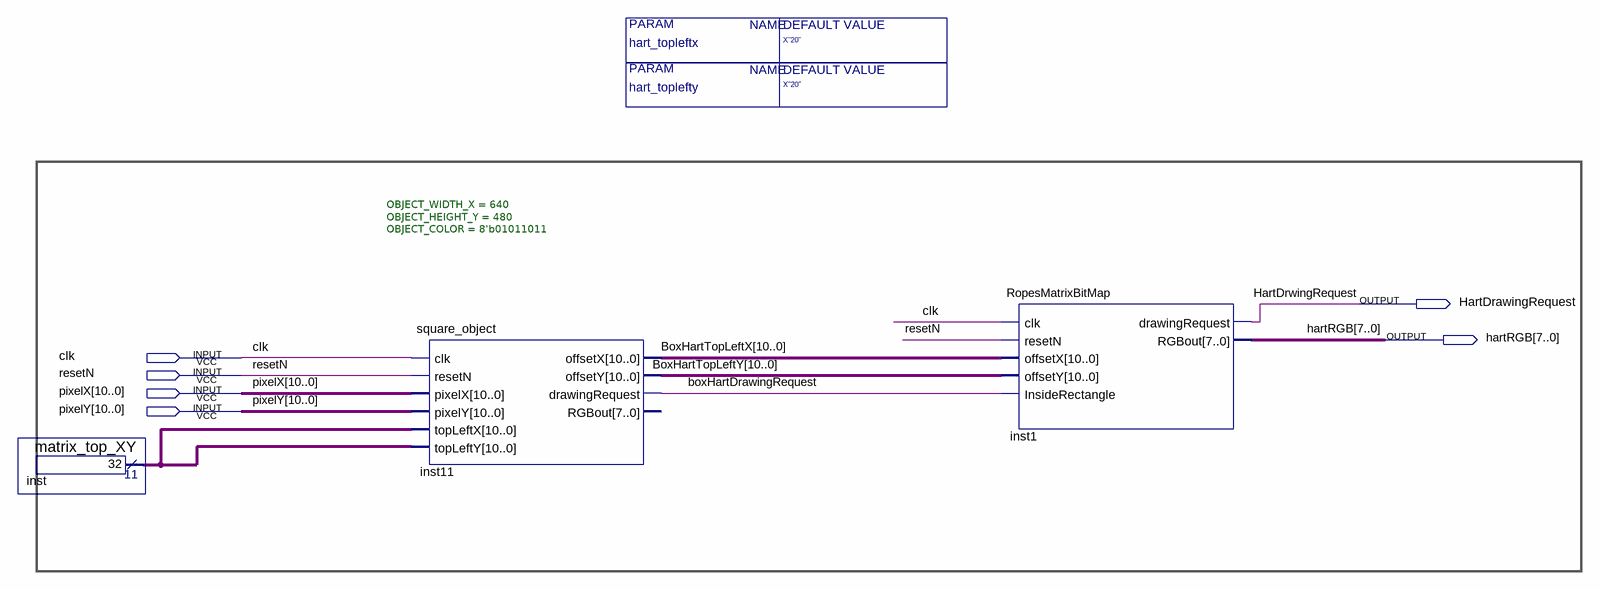
[diagram p0: schematic sheet]
// Quartus schematic ROPE_DISPLAY.bdf as structural Verilog: 3 symbols, 6 pins
module ROPE_DISPLAY #(parameter hart_topleftx = "X\"20\"", parameter hart_toplefty = "X\"20\"") (
  input  clk,
  input  resetN,
  input  [10:0] pixelX,
  input  [10:0] pixelY,
  output HartDrawingRequest,
  output [7:0] hartRGB
);

  wire boxHartDrawingRequest;
  wire [10:0] BoxHartTopLeftX, BoxHartTopLeftY, inst_result;

  matrix_top_XY inst (.result(inst_result));
  square_object #(.OBJECT_WIDTH_X(640), .OBJECT_HEIGHT_Y(480), .OBJECT_COLOR(8'b01011011)) inst11 (
    .clk(clk), .resetN(resetN), .pixelX(pixelX), .pixelY(pixelY), .topLeftX(inst_result),
    .topLeftY(inst_result), .offsetX(BoxHartTopLeftX), .offsetY(BoxHartTopLeftY),
    .drawingRequest(boxHartDrawingRequest));  // open: RGBout
  RopesMatrixBitMap inst1 (
    .clk(clk), .resetN(resetN), .offsetX(BoxHartTopLeftX), .offsetY(BoxHartTopLeftY),
    .InsideRectangle(boxHartDrawingRequest), .drawingRequest(HartDrawingRequest), .RGBout(hartRGB));

  // Other names for the same wires on the sheet: HartDrwingRequest = HartDrawingRequest
endmodule
